# Altium schematic sheet Power_LDO_3V3.SchDoc: 3.3V LDO
size Letter; Engineer: Nathan Petersen; DocumentNumber: 8; Revision: v1.2; SheetNumber: 8; SheetTotal: 29
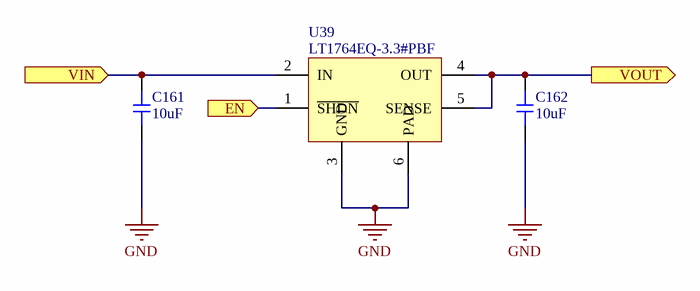
[diagram p0: Power_LDO_3V3.SchDoc]

## Parts
C161  value 10uF  [0603-CAP]  (hidden comment: Capacitor)
C162  value 10uF  [0603-CAP]  (hidden comment: Capacitor)
U39  LT1764EQ-3.3#PBF  [5-DDPAK]

## Ports
EN (in), VIN (in), VOUT (out)

## Nets
GND: C161.2 C162.2 U39.3(GND) U39.6(PAD)
EN: U39.1(~{SHDN}) ; port EN
VIN: C161.1 U39.2(IN) ; port VIN
VOUT: C162.1 U39.4(OUT) U39.5(SENSE) ; port VOUT

## Notes on the sheet
- Title:
- File:
- Sheet:
- of
- Revision:
- Time:
- Date:
- Engineer:

## Library data of the parts
C161 C162 = Capacitor: Manufacturer: Samsung; Manufacturer Part Number: CL10A106KP8NNNC; Material: Ceramic; Tolerance: 10%; Voltage Rating: 10V; Dielectric: X5R; Supplier 1: Digi-Key; Supplier Part Number 1: 1276-1192-6-ND; Stock 1: 40000; Pricing 1: 1=0.36, 10=0.248, 100=0.1403, 500=0.099, 1000=0.08663 (USD); Mount: Surface Mount; Case/Package: 0603; Case Code (Metric): 1608; Case Code (Imperial): 0603; Contact Plating: Tin; Min Operating Temperature: -55°C; Max Operating Temperature: 85°C; Capacitance: 10uF; Package Quantity: 1; Packaging: Tape and Reel; Voltage Rating (DC): 10V; Length: 1.6mm; Height: 0.8mm; Width: 0.031inch; Thickness: 0.035inch; Depth: 0.8mm; Radiation Hardening: No; Lead Free: Lead Free; ComponentLink1URL: https://datasheet.ciiva.com/26877/getdatasheetpartid-359551-26877881.pdf; ComponentLink1Description: https://datasheet.ciiva.com/26877/getdatasheetpartid-359551-26877881.pdf; ComponentLink2URL: https://datasheet.ciiva.com/16200/cl05b104kq5nnnc-16200766.pdf; ComponentLink2Description: https://datasheet.ciiva.com/16200/cl05b104kq5nnnc-16200766.pdf; ComponentLink3URL: https://datasheet.ciiva.com/29198/457369-da-01-en-vs-kondensator-0603-29198790.pdf; ComponentLink3Description: https://datasheet.ciiva.com/29198/457369-da-01-en-vs-kondensator-0603-29198790.pdf
U39 = LT1764EQ-3.3#PBF: IC REG LINEAR 3.3V 3A 5DDPAK; Manufacturer: Analog Devices / Linear Technology; Number of Outputs: 1; Min Input Voltage: 2.7V; Dropout Voltage: 340mV; Max Input Voltage: 20V; Min Current Limit: 3.1A; Polarity: Positive; Quiescent Current: 1mA; Output Type: Fixed; Supplier 1: Digi-Key; Supplier Part Number 1: LT1764EQ-3.3#PBF-ND; Manufacturer Part Number: LT1764EQ-3.3#PBF; Stock 1: 1035; Pricing 1: 1=7.56, 25=5.192, 100=4.2738 (USD); Mount: Surface Mount; Case/Package: TO-263-6; Number of Pins: 5; Min Operating Temperature: -40°C; Max Operating Temperature: 125°C; Output Voltage: 3.3V; Output Current: 3A; Package Quantity: 50; Packaging: Rail/Tube; Max Output Current: 3A; Nominal Output Voltage: 3.3V; Number of Regulators: 1; Length: 10.54mm; Height: 4.57mm; Width: 9.4mm; REACH SVHC: No SVHC; Lead Free: Lead Free; ComponentLink1URL: https://datasheet.ciiva.com/2041/3538-2041701.pdf; ComponentLink1Description: https://datasheet.ciiva.com/2041/3538-2041701.pdf; ComponentLink2URL: https://datasheet.ciiva.com/7003/1576447-7003513.pdf; ComponentLink2Description: https://datasheet.ciiva.com/7003/1576447-7003513.pdf; ComponentLink3URL: https://datasheet.ciiva.com/8041/1576447-8041805.pdf; ComponentLink3Description: https://datasheet.ciiva.com/8041/1576447-8041805.pdf; ComponentLink4URL: https://datasheet.ciiva.com/19477/1740553-19477887.pdf; ComponentLink4Description: https://datasheet.ciiva.com/19477/1740553-19477887.pdf; ComponentLink5URL: https://datasheet.ciiva.com/26906/lt1764eq-3-3-pbf-26906033.pdf; ComponentLink5Description: https://datasheet.ciiva.com/26906/lt1764eq-3-3-pbf-26906033.pdf